# Altium schematic sheet Sheet1.SchDoc: Wireless led motherboard
size A4; Author: Michał Lichtarski; CompanyName: ULP; Engineer: Michał Lichtarski; Revision: 2.0; SheetNumber: 1; SheetTotal: 1
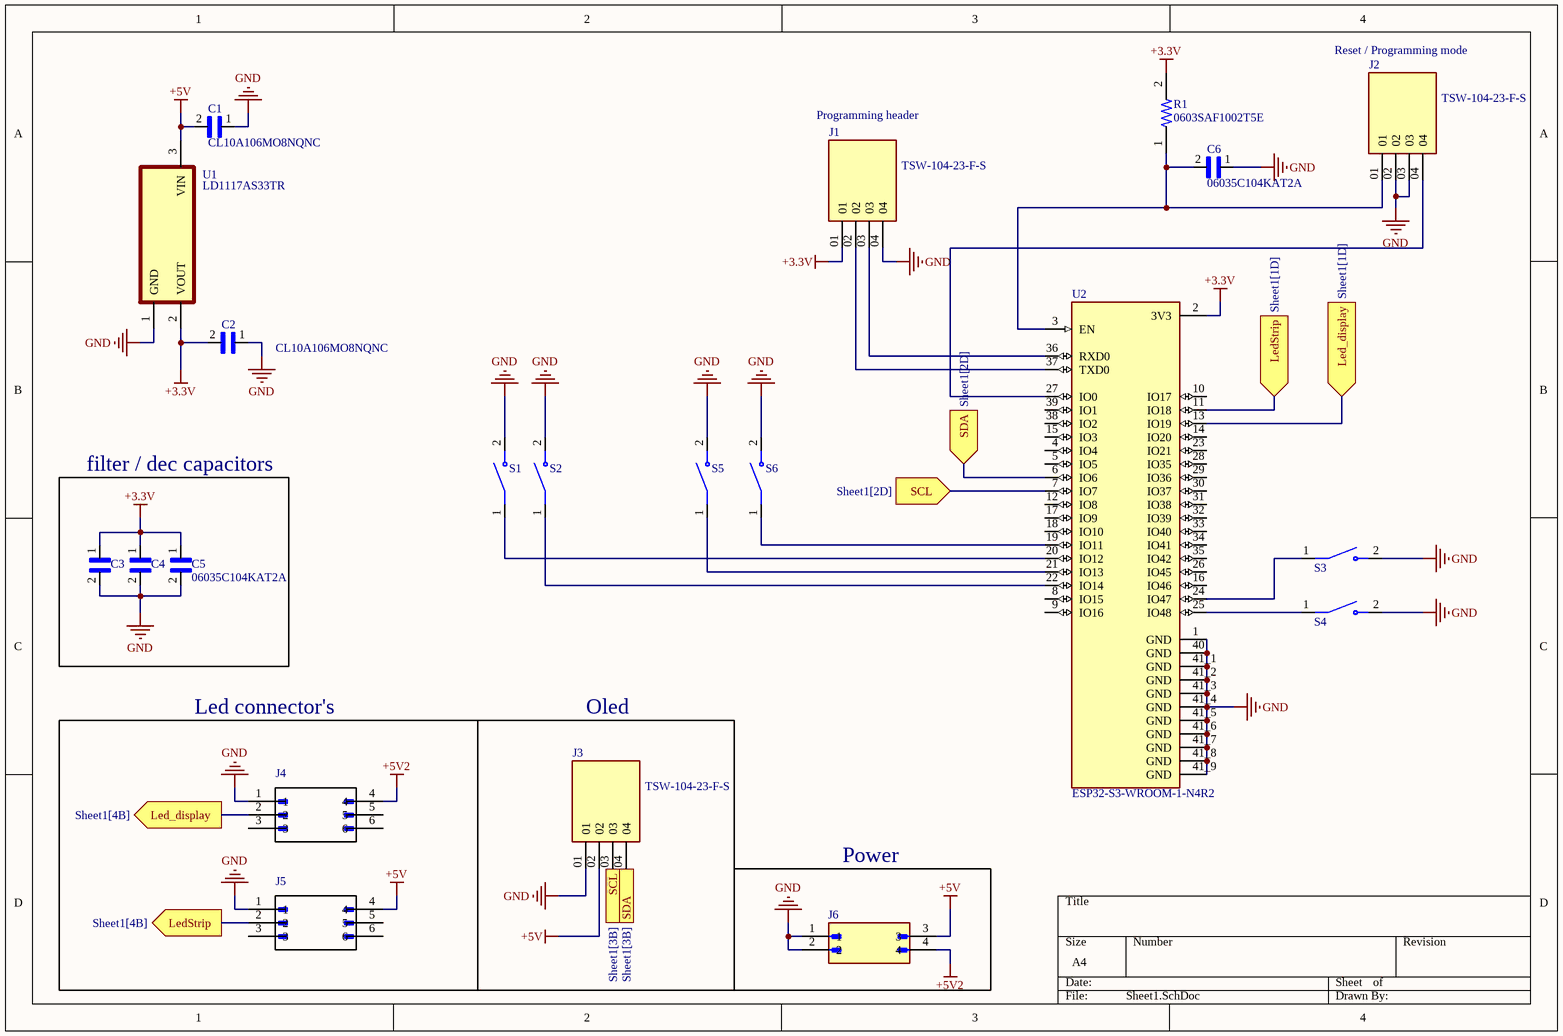
[diagram p0: Sheet1.SchDoc]

## Parts
C1  CL10A106MO8NQNC  [CAPC1608X90N]
C2  CL10A106MO8NQNC  [CAPC1608X90N]
C3  06035C104KAT2A  [CAPC1608X90N]  (value not drawn)
C4  06035C104KAT2A  [CAPC1608X90N]  (value not drawn)
C5  06035C104KAT2A  [CAPC1608X90N]
C6  06035C104KAT2A  [CAPC1608X90N]
J1  TSW-104-23-F-S  [SAMTEC_TSW-104-23-F-S]
J2  TSW-104-23-F-S  [SAMTEC_TSW-104-23-F-S]
J3  TSW-104-23-F-S  [SAMTEC_TSW-104-23-F-S]
J4  874270602  [*MOLEX_874270602]  (value not drawn)
J5  874270602  [*MOLEX_874270602]  (value not drawn)
J6  353180420  [*MOLEX_353180420]  (value not drawn)
R1  0603SAF1002T5E  [RESC1608X50N]
S1  TL1107BF130WQ  [SW_MX_reversible]  (value not drawn)
S2  TL1107BF130WQ  [SW_MX_reversible]  (value not drawn)
S3  TL1107BF130WQ  [SW_MX_reversible]  (value not drawn)
S4  TL1107BF130WQ  [SW_MX_reversible]  (value not drawn)
S5  TL1107BF130WQ  [SW_MX_reversible]  (value not drawn)
S6  TL1107BF130WQ  [SW_MX_reversible]  (value not drawn)
U1  LD1117AS33TR  [SOT230P700X180-4N]
U2  ESP32-S3-WROOM-1-N4R2  [XCVR_ESP32-S3-WROOM-1-N4R2]

## Blocks framed on the sheet
filter / dec capacitors: C3-C5
Power: J6

## Ports
Led_display (in, see Sheet1[1D]), Led_display (out, see Sheet1[4B]), LedStrip (in, see Sheet1[1D]), LedStrip (out, see Sheet1[4B]), SCL (in, see Sheet1[2D]), SCL (out, see Sheet1[3B]), SDA (in, see Sheet1[2D]), SDA (out, see Sheet1[3B])

## Nets
+3.3V: C2.2 C3.1 C4.1 C5.1 J1.01 R1.2 U1.2(VOUT) U2.2(3V3)
+5V: C1.2 J3.02 J5.4 J6.3 U1.3(VIN)
+5V2: J4.4 J6.4
GND: C1.1 C2.1 C3.2 C4.2 C5.2 C6.1 J1.04 J2.02 J2.03 J3.01 J4.1 J5.1 J6.1 J6.2 S1.2 S2.2 S3.2 S4.2 S5.2 S6.2 U1.1(GND) U2.1(GND) U2.40(GND) U2.41_1(GND) U2.41_2(GND) U2.41_3(GND) U2.41_4(GND) U2.41_5(GND) U2.41_6(GND) U2.41_7(GND) U2.41_8(GND) U2.41_9(GND)
Led_display: J4.2 U2.13(IO19) ; port Led_display
LedStrip: J5.2 U2.11(IO18) ; port LedStrip
SCL: J3.03 U2.7(IO7) ; port SCL
SDA: J3.04 U2.6(IO6) ; port SDA
NetC6_2: C6.2 J2.01 R1.1 U2.3(EN)
NetJ1_02: J1.02 U2.37(TXD0)
NetJ1_03: J1.03 U2.36(RXD0)
NetJ2_04: J2.04 U2.27(IO0)
NetS1_1: S1.1 U2.20(IO12)
NetS2_1: S2.1 U2.22(IO14)
NetS3_1: S3.1 U2.24(IO47)
NetS4_1: S4.1 U2.25(IO48)
NetS5_1: S5.1 U2.21(IO13)
NetS6_1: S6.1 U2.19(IO11)

Not connected (* = marked no-connect by the designer): J4 3 5 6; J5 3 5 6; U2 4(IO4) 5(IO5) 8(IO15) 9(IO16) 10(IO17) 12(IO8) 14(IO20) 15(IO3) 16(IO46) 17(IO9) 18(IO10) 23(IO21) 26(IO45) 28(IO35) 29(IO36) 30(IO37) 31(IO38) 32(IO39) 33(IO40) 34(IO41) 35(IO42) 38(IO2) 39(IO1)

## Notes on the sheet
- Reset / Programming mode
- Programming header
- Led connector's
- Oled

## Library data of the parts
C1 C2 = CL10A106MO8NQNC: Cap Ceramic 10uF 16V X5R 20% SMD 0603 85Â°C Paper T/R; MF: {'manufacturer': u'Samsung Electro-Mechanics'}; Package: None; Price: None; Value: *; MP: CL10A106MO8NQNC; Availability: Unavailable
C3-C6 = 06035C104KAT2A: CAPACITOR, 0603, 100NF, 50V, X7R; Application:Standard; Capacitance:100000pF; Capacitance Tolerance:Â± 10%; Series:06035C; Voltage, Rating:50V dc; Capacitor Dielectric Type:Ceramic Multi-Layer; Case Style:0603; Termination Type:SMD; Dielectric Characteristic:X7R; Max Operating Temperature:125Â°C; Min Temperature Operating:-55Â°C; Operating Temperature Range:-55Â°C to +125Â°C; Terminal Type:Surface Mount (SMD, SMT); Tolerance, +:10%; Tolerance, -:10%; Voltage Rating, DC:50V; MF: {'manufacturer': u'AVX'}; Package: None; Price: None; Value: *; MP: 06035C104KAT2A; Availability: Unavailable
J1-J3 = TSW-104-23-F-S: MF: {'manufacturer': u'Samtec'}; Package: None; Price: None; Value: *; MP: TSW-104-23-F-S; Availability: Unavailable
J6 = 353180420: Connector Header Through Hole, Right Angle 4 position 0.165in (4.20mm); MF: {'manufacturer': u'Molex'}; Package: None; Price: None; Value: *; MP: 353180420; Availability: Unavailable
R1 = RP73PF1J10KBTDF: 0603 10k ohm; MF: {'manufacturer': u'TE Connectivity'}; Package: None; Price: None; Value: *; MP: RP73PF1J10KBTDF; Availability: Unavailable
S1-S6 = TL1107BF130WQ: MF: {'manufacturer': u'E-Switch'}; Package: None; Price: None; Value: *; MP: TL1107BF130WQ; Availability: Unavailable
U1 = LD1117AS33TR: MF: {'manufacturer': u'STMicroelectronics'}; Package: None; Price: None; Value: *; MP: LD1117AS33TR; Availability: Unavailable
U2 = ESP32-S3-WROOM-1-N4R2: MF: {'manufacturer': u'Espressif Systems'}; Package: None; Price: None; Value: *; MP: ESP32-S3-WROOM-1-N4R2; Availability: Unavailable
J4 J5 = 874270602: Value: *